# Altium schematic sheet EEM_Connectors.SchDoc: =SheetTitle_Top
size 420 x 297 mm; EDA_Number: ARTIQ; Projet: Sensor Box; SPICEModelCacheVGBTAUBO: <root> / <DocumentId>VGBTAUBO</DocumentId> / <CacheFrame Number="0"> / <Model Name="pk14" Kind="CKT"> / <Text>*.INC dhvqfn.s / .SUBCKT pk14 / +    1   2   3   4   5   6   7   8   9  10 / +   11  12  13  14 / +   15  16  17  18  19  20  21  22  23  24 / +   25  26  27  28 / * Pin Resistance / r1 1 1001 9.078E-02 / r2 2 1002 8.829E-02 / r3 3 1003 8.731E-02 / r4 4 1004 8.710E-02 / r5 5 1005 8.731E-02 / r6 6 1006 8.829E-02 / r7 7 1007 9.075E-02 / r8 8 1008 9.072E-02 / r9 9 1009 8.809E-02 / r10 10 1010 8.716E-02 / r11 11 1011 8.706E-02 / r12 12 1012 8.720E-02 / r13 13 1013 8.816E-02 / r14 14 1014 9.068E-02 / * Pin Inductance / l1 1001 15 2.981E-09 / l2 1002 16 2.447E-09 / l3 1003 17 2.304E-09 / l4 1004 18 2.291E-09 / l5 1005 19 2.307E-09 / l6 1006 20 2.449E-09 / l7 1007 21 2.971E-09 / l8 1008 22 2.972E-09 / l9 1009 23 2.425E-09 / l10 1010 24 2.286E-09 / l11 1011 25 2.280E-09 / l12 1012 26 2.286E-09 / l13 1013 27 2.425E-09 / l14 1014 28 2.975E-09 / .ENDS pk14</Text> / </Model> / </CacheFrame> / </root>; Author: G.Kasprowicz; CompanyName: WUT ISE; DrawnBy: G.Kasprowicz; Organization: WUT ISE; Address1: PW ISE; Address2: Nowowiejska 15/19 00-665 Warsaw; Address3: gkasprow@gmail.com; ModifiedBy: -; CheckedDate: -; Title2: EEM Connectors; DivGrp: WUT ISE; Designer: G.Kasprowicz; ModifiedDate: -; ProjectName: Sensor Box
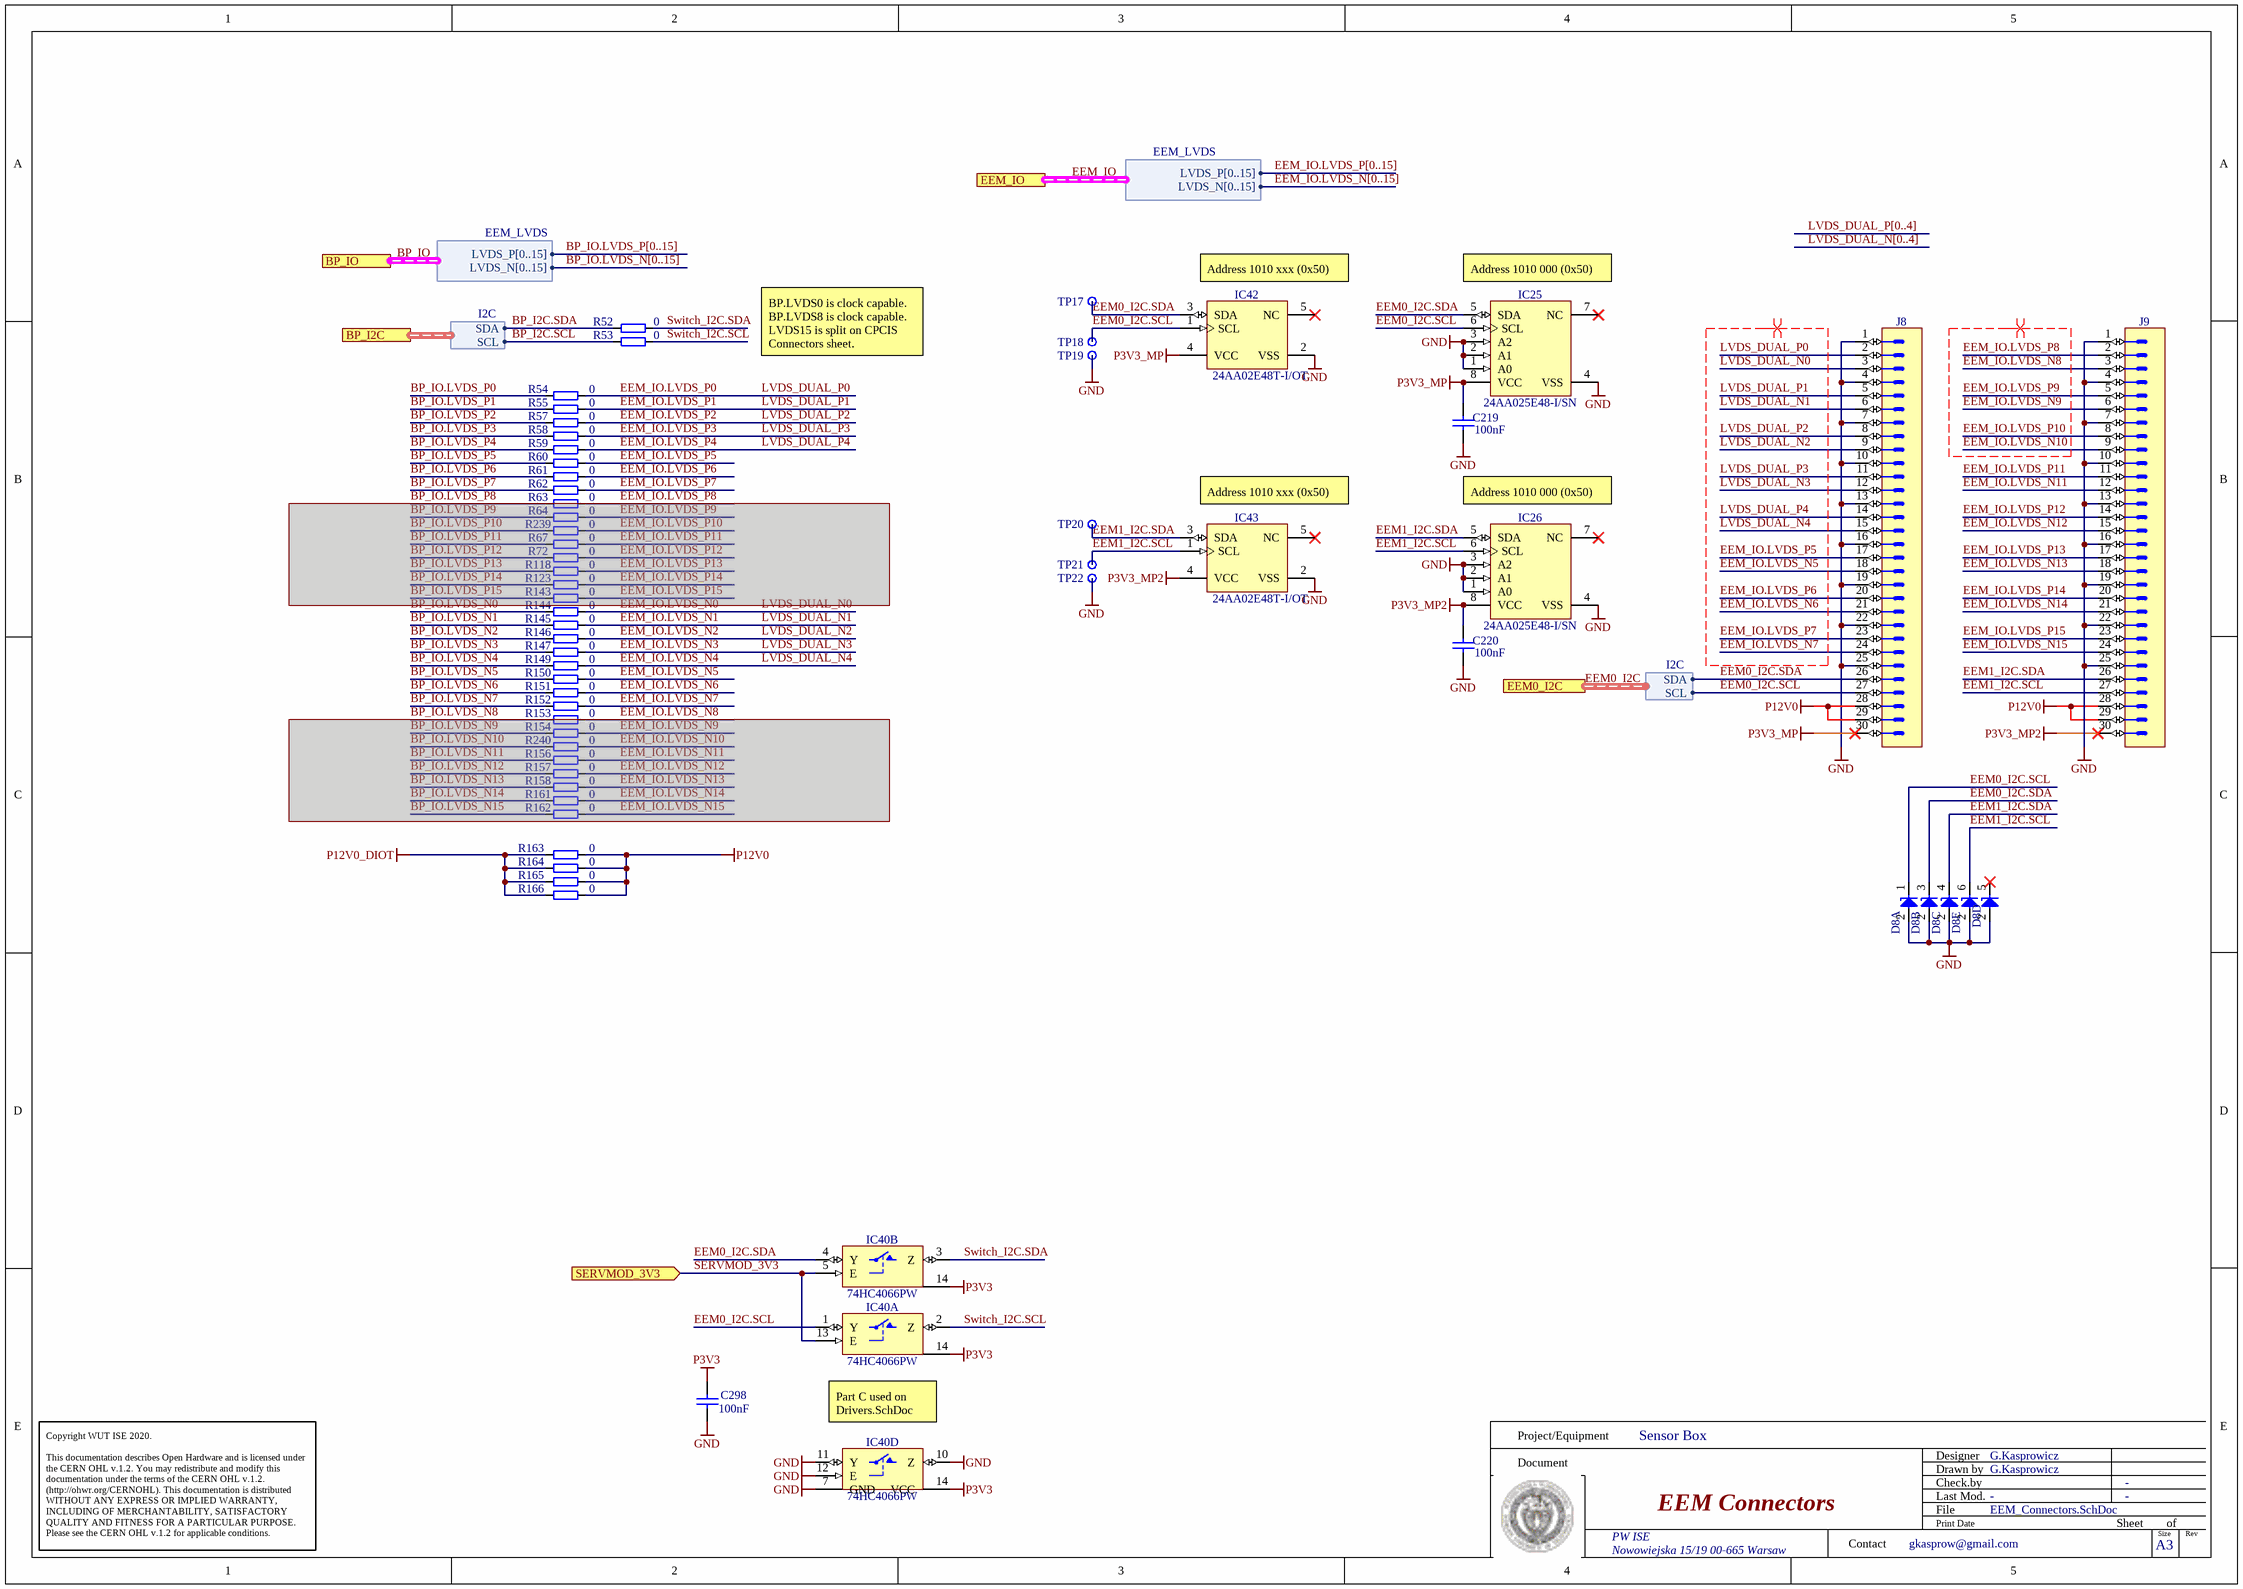
[diagram p0: EEM_Connectors.SchDoc]

## Parts
C219  100nF  [CAPC1005X55N]
C220  100nF  [CAPC1005X55N]
C298  100nF  [CAPC1005X55N]
D8  PESD3V3L5UY  [SOT65P210X110-6N]  (value not drawn)  (parts A,B,C,D,E of 5)
IC25  24AA025E48-I/SN  [SOIC127P600X175-8N]
IC26  24AA025E48-I/SN  [SOIC127P600X175-8N]
IC40  74HC4066PW  [SOP65P640X110-14N]  (parts A,B,D of 4)
IC42  24AA02E48T-I/OT  [SOT95P280X145-5N]
IC43  24AA02E48T-I/OT  [SOT95P280X145-5N]
J8  (no value)  [3M_N2530-6002RB]
J9  (no value)  [3M_N2530-6002RB]
R52  0  [RESC1005X40N]
R53  0  [RESC1005X40N]
R54  0  [RESC1005X40N]
R55  0  [RESC1005X40N]
R57  0  [RESC1005X40N]
R58  0  [RESC1005X40N]
R59  0  [RESC1005X40N]
R60  0  [RESC1005X40N]
R61  0  [RESC1005X40N]
R62  0  [RESC1005X40N]
R63  0  [RESC1005X40N]  (masked out: inside a compile mask, not in the netlist)
R64  0  [RESC1005X40N]  (masked out: inside a compile mask, not in the netlist)
R67  0  [RESC1005X40N]  (masked out: inside a compile mask, not in the netlist)
R72  0  [RESC1005X40N]  (masked out: inside a compile mask, not in the netlist)
R118  0  [RESC1005X40N]  (masked out: inside a compile mask, not in the netlist)
R123  0  [RESC1005X40N]  (masked out: inside a compile mask, not in the netlist)
R143  0  [RESC0603X28N]  (masked out: inside a compile mask, not in the netlist)
R144  0  [RESC1005X40N]
R145  0  [RESC1005X40N]
R146  0  [RESC1005X40N]
R147  0  [RESC1005X40N]
R149  0  [RESC1005X40N]
R150  0  [RESC1005X40N]
R151  0  [RESC1005X40N]
R152  0  [RESC1005X40N]
R153  0  [RESC1005X40N]  (masked out: inside a compile mask, not in the netlist)
R154  0  [RESC1005X40N]  (masked out: inside a compile mask, not in the netlist)
R156  0  [RESC1005X40N]  (masked out: inside a compile mask, not in the netlist)
R157  0  [RESC1005X40N]  (masked out: inside a compile mask, not in the netlist)
R158  0  [RESC1005X40N]  (masked out: inside a compile mask, not in the netlist)
R161  0  [RESC1005X40N]  (masked out: inside a compile mask, not in the netlist)
R162  0  [RESC0603X28N]  (masked out: inside a compile mask, not in the netlist)
R163  0  [RESC1005X40N]
R164  0  [RESC1005X40N]
R165  0  [RESC1005X40N]
R166  0  [RESC1005X40N]
R239  0  [RESC1005X40N]  (masked out: inside a compile mask, not in the netlist)
R240  0  [RESC1005X40N]  (masked out: inside a compile mask, not in the netlist)
TP17  Test Point  [TPS127]  (value not drawn)  (no BOM)
TP18  Test Point  [TPS127]  (value not drawn)  (no BOM)
TP19  Test Point  [TPS127]  (value not drawn)  (no BOM)
TP20  Test Point  [TPS127]  (value not drawn)  (no BOM)
TP21  Test Point  [TPS127]  (value not drawn)  (no BOM)
TP22  Test Point  [TPS127]  (value not drawn)  (no BOM)

## Ports
BP_I2C (harness I2C), BP_IO (harness EEM_LVDS), EEM0_I2C (harness I2C), EEM_IO (harness EEM_LVDS), SERVMOD_3V3 (in)

## Harnesses
I2C: SDA, SCL
EEM_LVDS: LVDS_P[0..15], LVDS_N[0..15]

## Nets
GND: C219.1 C220.1 C298.1 D8.2(A) IC25.1(A0) IC25.2(A1) IC25.3(A2) IC25.4(VSS) IC26.1(A0) IC26.2(A1) IC26.3(A2) IC26.4(VSS) IC40.7(GND) IC40.10(Z) IC40.11(Y) IC40.12(E) IC42.2(VSS) IC43.2(VSS) J8.1 J8.4 J8.7 J8.10 J8.13 J8.16 J8.19 J8.22 J8.25 J9.1 J9.4 J9.7 J9.10 J9.13 J9.16 J9.19 J9.22 J9.25 TP19.1 TP22.1
P3V3: C298.2 IC40.14(VCC)
P3V3_MP: C219.2 IC25.8(VCC) IC42.4(VCC) J8.30
P3V3_MP2: C220.2 IC26.8(VCC) IC43.4(VCC) J9.30
P12V0: J8.28 J8.29 J9.28 J9.29 R163.2 R164.2 R165.2 R166.2
P12V0_DIOT: R163.1 R164.1 R165.1 R166.1
BP_I2C.SCL: R53.1 ; port BP_I2C.SCL
BP_I2C.SDA: R52.1 ; port BP_I2C.SDA
BP_IO.LVDS_N0: R144.1
BP_IO.LVDS_N1: R145.1
BP_IO.LVDS_N2: R146.1
BP_IO.LVDS_N3: R147.1
BP_IO.LVDS_N4: R149.1
BP_IO.LVDS_N5: R150.1
BP_IO.LVDS_N6: R151.1
BP_IO.LVDS_N7: R152.1
BP_IO.LVDS_P0: R54.1
BP_IO.LVDS_P1: R55.1
BP_IO.LVDS_P2: R57.1
BP_IO.LVDS_P3: R58.1
BP_IO.LVDS_P4: R59.1
BP_IO.LVDS_P5: R60.1
BP_IO.LVDS_P6: R61.1
BP_IO.LVDS_P7: R62.1
EEM0_I2C.SCL: D8.1(C) IC25.6(SCL) IC40.1(Y) IC42.1(SCL) J8.27 TP18.1 ; port EEM0_I2C.SCL
EEM0_I2C.SDA: D8.3(C) IC25.5(SDA) IC40.4(Y) IC42.3(SDA) J8.26 TP17.1 ; port EEM0_I2C.SDA
EEM1_I2C.SCL: D8.6(C) IC26.6(SCL) IC43.1(SCL) J9.27 TP21.1
EEM1_I2C.SDA: D8.4(C) IC26.5(SDA) IC43.3(SDA) J9.26 TP20.1
EEM_IO.LVDS_N0: J8.3 R144.2  [also labelled LVDS_DUAL_N0]
EEM_IO.LVDS_N1: J8.6 R145.2  [also labelled LVDS_DUAL_N1]
EEM_IO.LVDS_N2: J8.9 R146.2  [also labelled LVDS_DUAL_N2]
EEM_IO.LVDS_N3: J8.12 R147.2  [also labelled LVDS_DUAL_N3]
EEM_IO.LVDS_N4: J8.15 R149.2  [also labelled LVDS_DUAL_N4]
EEM_IO.LVDS_N5: J8.18 R150.2
EEM_IO.LVDS_N6: J8.21 R151.2
EEM_IO.LVDS_N7: J8.24 R152.2
EEM_IO.LVDS_N8: J9.3
EEM_IO.LVDS_N9: J9.6
EEM_IO.LVDS_N10: J9.9
EEM_IO.LVDS_N11: J9.12
EEM_IO.LVDS_N12: J9.15
EEM_IO.LVDS_N13: J9.18
EEM_IO.LVDS_N14: J9.21
EEM_IO.LVDS_N15: J9.24
EEM_IO.LVDS_P0: J8.2 R54.2  [also labelled LVDS_DUAL_P0]
EEM_IO.LVDS_P1: J8.5 R55.2  [also labelled LVDS_DUAL_P1]
EEM_IO.LVDS_P2: J8.8 R57.2  [also labelled LVDS_DUAL_P2]
EEM_IO.LVDS_P3: J8.11 R58.2  [also labelled LVDS_DUAL_P3]
EEM_IO.LVDS_P4: J8.14 R59.2  [also labelled LVDS_DUAL_P4]
EEM_IO.LVDS_P5: J8.17 R60.2
EEM_IO.LVDS_P6: J8.20 R61.2
EEM_IO.LVDS_P7: J8.23 R62.2
EEM_IO.LVDS_P8: J9.2
EEM_IO.LVDS_P9: J9.5
EEM_IO.LVDS_P10: J9.8
EEM_IO.LVDS_P11: J9.11
EEM_IO.LVDS_P12: J9.14
EEM_IO.LVDS_P13: J9.17
EEM_IO.LVDS_P14: J9.20
EEM_IO.LVDS_P15: J9.23
SERVMOD_3V3: IC40.5(E) IC40.13(E) ; port SERVMOD_3V3
Switch_I2C.SCL: IC40.2(Z) R53.2
Switch_I2C.SDA: IC40.3(Z) R52.2

Not connected (* = marked no-connect by the designer): D8 5(C)*; IC25 7(NC)*; IC26 7(NC)*; IC42 5(NC)*; IC43 5(NC)*

## Buses and harness runs
bus BP_IO.LVDS_N[0..15]
bus BP_IO.LVDS_P[0..15]
bus EEM_IO.LVDS_N[0..15]
bus EEM_IO.LVDS_P[0..15]
bus LVDS_DUAL_N[0..4]
bus LVDS_DUAL_P[0..4]
harness BP_IO = port BP_IO
harness EEM0_I2C = port EEM0_I2C
harness EEM_IO = port EEM_IO

## Layout directives
differential pair; differential pair class Diff_100Ohm: EEM_IO.LVDS_N5, EEM_IO.LVDS_N6, EEM_IO.LVDS_N7, EEM_IO.LVDS_N8, EEM_IO.LVDS_N9, EEM_IO.LVDS_N10, EEM_IO.LVDS_P5, EEM_IO.LVDS_P6, EEM_IO.LVDS_P7, EEM_IO.LVDS_P8, EEM_IO.LVDS_P9, EEM_IO.LVDS_P10, LVDS_DUAL_N0, LVDS_DUAL_N1, LVDS_DUAL_N2, LVDS_DUAL_N3, LVDS_DUAL_N4, LVDS_DUAL_P0, LVDS_DUAL_P1, LVDS_DUAL_P2, LVDS_DUAL_P3, LVDS_DUAL_P4

## Notes on the sheet
- (near IC42) Address 1010 xxx (0x50)
- (near IC25) Address 1010 000 (0x50)
- BP.LVDS0 is clock capable.
  BP.LVDS8 is clock capable.
  LVDS15 is split on CPCIS Connectors sheet.
- (near IC43) Address 1010 xxx (0x50)
- Address 1010 000 (0x50)
- (near IC40) Part C used on Drivers.SchDoc
- Project/Equipment
- Document
- Designer
- Drawn by
- Check.by
- Copyright WUT ISE 2020.
  This documentation describes Open Hardware and is licensed under the CERN OHL v.1.2. You may redistribute and modify this documentation under the terms of the CERN OHL v.1.2. (http://ohwr.org/CERNOHL). This documentation is distributed WITHOUT ANY EXPRESS OR IMPLIED WARRANTY, INCLUDING OF MERCHANTABILITY, SATISFACTORY QUALITY AND FITNESS FOR A PARTICULAR PURPOSE. Please see the CERN OHL v.1.2 for applicable conditions.
- Contact
- File
- Last Mod.
- Print Date
- Sheet
- Size
- A3
- of
- Rev

## Library data of the parts
C219 C220 C298 = CC0402_100NF_16V_10%_X5R: Non-polarised capacitor; Part Description: SMD Multilayer Chip Ceramic Capacitor; Manufacturer: GENERIC; Manufacturer1 Part Number: GRM155R61C104KA88D; Voltage: 16V; TC: X5R; Tolerance: ±10%; Part Number: CC0402_100NF_16V_10%_X5R; Component Kind: Standard; Component Type: Standard; Pin Count: 2; Value: 100nF; Status: None; Manufacturer Part Number: CC0402_100NF_16V_10%_X5R; Case: 0402; Mounted: Yes; Socket: No; SMD: Yes; Sense: No; Manufacturer1 Example: MURATA; Manufacturer1 ComponentHeight: 0.55mm; HelpURL: \\cern.ch\dfs\Applications\Altium\Datasheets\CC0402_X5R_MURATA_GRM.pdf; Author: CERN DEM JLC; CreateDate: 10.12.2013; LatestRevisionDate: 10.12.2013
D8 = PESD3V3L5UY: Fivefold ESD Protection Diode Arrays; Part Description: Fivefold ESD Protection Diode Arrays (30kV); Manufacturer: NEXPERIA; Voltage: 3.3V; Power: 200W; PressFit: No; Bonding: No; Part Number: PESD3V3L5UY; Component Kind: Standard; Component Type: Standard; Device: PESD3V3L5UY; PackageDescription: SOT363, SC-88, 0.65mm Pitch; 6 Pin, 1.25mm W X 2.00mm L X 1.10mm H body, IPC Medium Density; Manufacturer Part Number: PESD3V3L5UY; Pin Count: 6; Case: SOT363; Mounted: Yes; Socket: No; SMD: Yes; Sense: No; ComponentHeight: 1.1mm; HelpURL: \\cern.ch\dfs\Applications\Altium\Datasheets\PESD3V3L5UY.pdf; Author: CERN DEM WB; CreateDate: 05.07.2021; LatestRevisionDate: 05.07.2021
IC25 IC26 = 24AA025E48-I/SN: 1.7V-5.5V, 2K I2C™ Serial EEPROMs with EUI-48™ Node Identity; Manufacturer: MICROCHIP TECHNOLOGY; PressFit: No; Bonding: No; Part Number: 24AA025E48-I/SN; Component Kind: Standard; Component Type: Standard; Device: 24AA025E48-I/SN; PackageDescription: SOIC 8, Pitch 1.27mm - Body 4x5mm, IPC Medium Density; Part Description: 1.7V-5.5V, 2K I2C™ Serial EEPROMs with EUI-48™ Node Identity; Manufacturer Part Number: 24AA025E48-I/SN; Pin Count: 8; Case: SOIC8; Mounted: Yes; Socket: No; SMD: Yes; Sense: No; ComponentHeight: 1.75mm; HelpURL: \\cern.ch\dfs\Applications\Altium\Datasheets\24AA025E48-I-SN.pdf; Author: CERN DEM MR; CreateDate: 19.07.2016; LatestRevisionDate: 19.07.2016
IC40 = 74HC4066PW: Part Description: Quad Single-Pole Single-Throw Analog Switch; Manufacturer: NXP SEMICONDUCTORS; PressFit: No; Bonding: No; Table: Standard Logic; Part Number: 74HC4066PW; Component Kind: Standard; Component Type: Standard; Device: 74HC4066PW; PackageDescription: SOP, 14-Leads, Body 4.4x5mm (max), Pitch 0.65mm, IPC Medium Density; Manufacturer Part Number: 74HC4066PW; Pin Count: 14; Case: TSSOP14; Mounted: Yes; Socket: No; SMD: Yes; ComponentHeight: 1.1mm; Author: CERN DEM JLC; HelpURL: \\cern.ch\dfs\Applications\Altium\Datasheets\74HC4066PW.pdf; CreateDate: 2014-11-19; LatestRevisionDate: 2014-11-19
IC42 IC43 = 24AA02E48T-I/OT: 1.7V-5.5V, 2K I2C Serial EEPROM With EUI-48 Node Identity; Manufacturer: MICROCHIP TECHNOLOGY; PressFit: No; Bonding: No; Part Number: 24AA02E48T-I/OT; Component Kind: Standard; Component Type: Standard; Device: 24AA02E48T-I/OT; PackageDescription: SOT, 0.95mm pitch; 5 pin, 1.60mm W X 2.90mm L X 1.45mm H body, IPC Medium Density; Part Description: 1.7V-5.5V, 2K I2C Serial EEPROM With EUI-48 Node Identity; Manufacturer Part Number: 24AA02E48T-I/OT; Pin Count: 5; Case: SOT23-5; Mounted: Yes; Socket: No; SMD: Yes; Sense: No; ComponentHeight: 1.45mm; HelpURL: \\cern.ch\dfs\Applications\Altium\Datasheets\24AA02E48T-I-OT.pdf; Author: CERN DEM MR; CreateDate: 31.03.2016; LatestRevisionDate: 31.03.2016
J8 J9 = 3M_N2530-6002RB: Connector 30 Male; Part Description: 30 Contacts - Straight .100'' x .100'' Low Profile Four-Wall Header, 2500 Series; Manufacturer: 3M; PressFit: No; Part Number: 3M_N2530-6002RB; Component Kind: Standard; Component Type: Standard; Pin Count: 30; Family: Header 30; Mounted: Yes; Socket: No; SMD: No; Sense: No; Status: None; Manufacturer Part Number: N2530-6002RB; ComponentHeight: 10.03mm; HelpURL: \\cern.ch\dfs\Applications\Altium\Datasheets\3M_N2530-6002RB.pdf; Author: CERN DEM JLC; CreateDate: 11.02.2009; LatestRevisionDate: 11.08.2009
R52-R55 R57-R64 R67 R72 R118 R123 R144-R147 R149-R154 R156-R158 R161 R163-R166 R239 R240 = R0402_0R_JUMPER: Resistor; Part Description: 1A (0.05R Max DC Resistance) Zero Ohm Jumper; Manufacturer: GENERIC; Manufacturer1 Part Number: 232270591001L; PressFit: No; Part Number: R0402_0R_JUMPER; Component Kind: Standard; Component Type: Standard; Pin Count: 2; Value: 0; Status: Not Recommended; Manufacturer Part Number: R0402_0R_JUMPER; Case: 0402; Mounted: Yes; Sense: No; Socket: No; SMD: Yes; Manufacturer1 Example: YAGEO PHYCOMP; Manufacturer1 ComponentHeight: 0.4mm; HelpURL: \\cern.ch\dfs\Applications\Altium\Datasheets\R0402_Phycomp_RC0402.pdf; Author: CERN DEM JLC; CreateDate: 03.12.2007; LatestRevisionDate: 17.10.2012
R143 R162 = R0201_0R_JUMPER: Resistor; Part Description: 1A (0.05R Max DC Resistance) Zero Ohm Jumper; Manufacturer: GENERIC; Manufacturer1 Part Number: CRCW02010000Z0ED; PressFit: No; Part Number: R0201_0R_JUMPER; Component Kind: Standard; Component Type: Standard; Pin Count: 2; Value: 0; Status: Not Recommended; Manufacturer Part Number: R0201_0R_JUMPER; Case: 0201; Mounted: Yes; Sense: No; Socket: No; SMD: Yes; Manufacturer1 Example: VISHAY; Manufacturer1 ComponentHeight: 0.27mm; HelpURL: \\cern.ch\dfs\Applications\Altium\Datasheets\R0201_VISHAY_CRCW e3.pdf; Author: CERN DEM JLC; CreateDate: 2014-11-19; LatestRevisionDate: 2015-01-08
TP17-TP22 = SMD_PAD_1.27X1.27MM: Part Description: 1.27mm x 1.27mm PCB Copper Area (SMD Test Point); Mounted: No; Part Number: SMD_PAD_1.27X1.27MM; Component Type: Standard (No BOM); Pin Count: 1; Family: Test Point; Socket: No; SMD: Yes; Sense: No; Status: None; ComponentHeight: 0mm; HelpURL: Undefined; Author: CERN DEM JLC; CreateDate: 12.01.2008; LatestRevisionDate: 12.01.2008; PackageDescription: 1.27mm x 1.27mm PCB Copper Area (SMD Test Point)